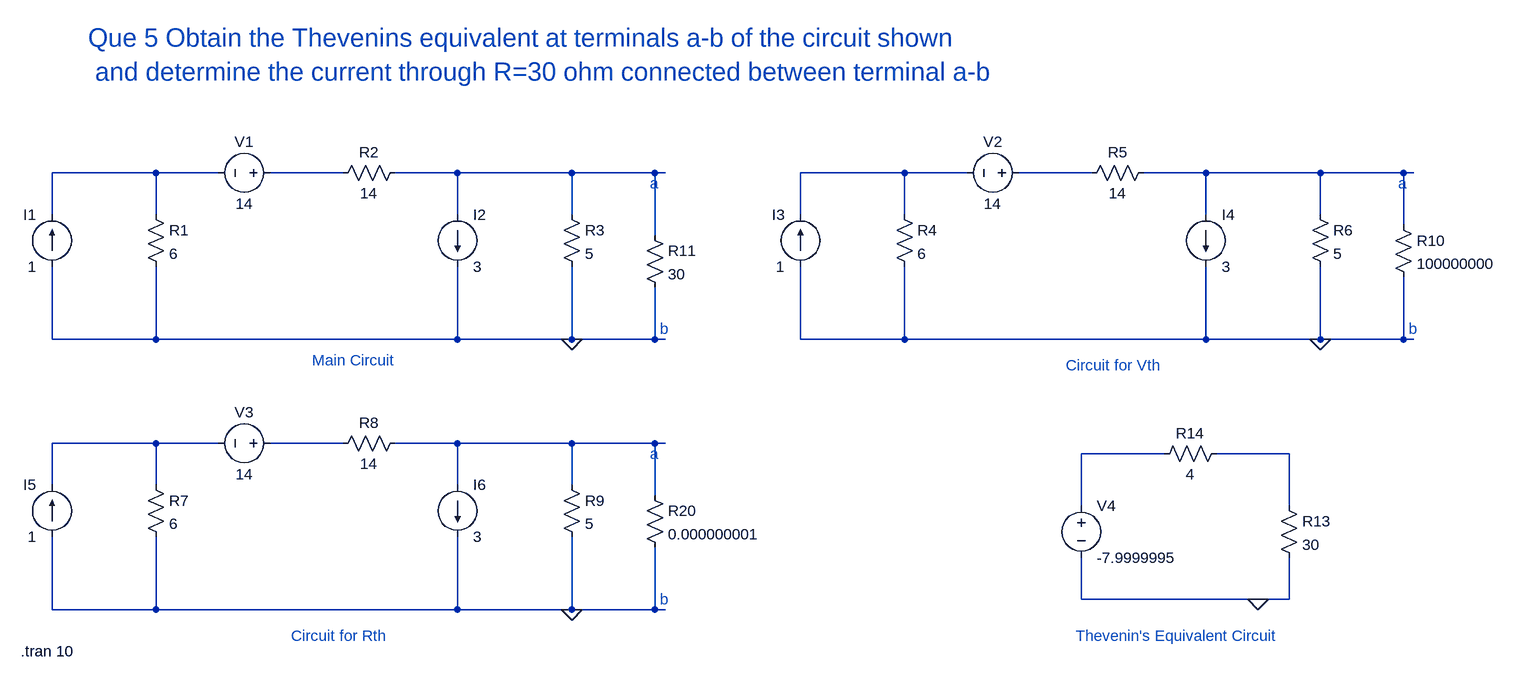
[diagram p0: schematic 5_Dheerendra_23EE019_Thevenins.asc]
5_Dheerendra_23EE019_Thevenins.asc, the LTspice schematic file:
Version 4
SHEET 1 2156 800
WIRE 80 48 -80 48
WIRE 176 48 80 48
WIRE 368 48 256 48
WIRE 544 48 448 48
WIRE 720 48 544 48
WIRE 848 48 720 48
WIRE 864 48 848 48
WIRE 1232 48 1072 48
WIRE 1328 48 1232 48
WIRE 1520 48 1408 48
WIRE 1696 48 1600 48
WIRE 1872 48 1696 48
WIRE 2000 48 1872 48
WIRE 2016 48 2000 48
WIRE -80 112 -80 48
WIRE 80 112 80 48
WIRE 544 112 544 48
WIRE 720 112 720 48
WIRE 1072 112 1072 48
WIRE 1232 112 1232 48
WIRE 1696 112 1696 48
WIRE 1872 112 1872 48
WIRE 2000 128 2000 48
WIRE 848 144 848 48
WIRE -80 304 -80 192
WIRE 80 304 80 192
WIRE 80 304 -80 304
WIRE 544 304 544 192
WIRE 544 304 80 304
WIRE 720 304 720 192
WIRE 720 304 544 304
WIRE 848 304 848 224
WIRE 848 304 720 304
WIRE 864 304 848 304
WIRE 1072 304 1072 192
WIRE 1232 304 1232 192
WIRE 1232 304 1072 304
WIRE 1696 304 1696 192
WIRE 1696 304 1232 304
WIRE 1872 304 1872 192
WIRE 1872 304 1696 304
WIRE 2000 304 2000 208
WIRE 2000 304 1872 304
WIRE 2016 304 2000 304
WIRE 80 464 -80 464
WIRE 176 464 80 464
WIRE 368 464 256 464
WIRE 544 464 448 464
WIRE 720 464 544 464
WIRE 848 464 720 464
WIRE 864 464 848 464
WIRE 1632 480 1504 480
WIRE 1824 480 1712 480
WIRE -80 528 -80 464
WIRE 80 528 80 464
WIRE 544 528 544 464
WIRE 720 528 720 464
WIRE 848 544 848 464
WIRE 1504 560 1504 480
WIRE 1824 560 1824 480
WIRE 1504 704 1504 640
WIRE 1776 704 1504 704
WIRE 1824 704 1824 640
WIRE 1824 704 1776 704
WIRE -80 720 -80 608
WIRE 80 720 80 608
WIRE 80 720 -80 720
WIRE 544 720 544 608
WIRE 544 720 80 720
WIRE 720 720 720 608
WIRE 720 720 544 720
WIRE 848 720 848 624
WIRE 848 720 720 720
WIRE 864 720 848 720
FLAG 720 304 0
FLAG 720 720 0
FLAG 1872 304 0
FLAG 1776 704 0
SYMBOL res 64 96 R0
SYMATTR InstName R1
SYMATTR Value 6
SYMBOL res 464 32 R90
WINDOW 0 0 56 VBottom 2
WINDOW 3 32 56 VTop 2
SYMATTR InstName R2
SYMATTR Value 14
SYMBOL voltage 272 48 R90
WINDOW 0 -32 56 VBottom 2
WINDOW 3 32 56 VTop 2
WINDOW 123 0 0 Left 0
WINDOW 39 0 0 Left 0
SYMATTR InstName V1
SYMATTR Value 14
SYMBOL current -80 192 R180
WINDOW 0 24 80 Left 2
WINDOW 3 24 0 Left 2
WINDOW 123 0 0 Left 0
WINDOW 39 0 0 Left 0
SYMATTR InstName I1
SYMATTR Value 1
SYMBOL current 544 112 R0
WINDOW 123 0 0 Left 0
WINDOW 39 0 0 Left 0
SYMATTR InstName I2
SYMATTR Value 3
SYMBOL res 704 96 R0
SYMATTR InstName R3
SYMATTR Value 5
SYMBOL res 1216 96 R0
SYMATTR InstName R4
SYMATTR Value 6
SYMBOL res 1616 32 R90
WINDOW 0 0 56 VBottom 2
WINDOW 3 32 56 VTop 2
SYMATTR InstName R5
SYMATTR Value 14
SYMBOL voltage 1424 48 R90
WINDOW 0 -32 56 VBottom 2
WINDOW 3 32 56 VTop 2
WINDOW 123 0 0 Left 0
WINDOW 39 0 0 Left 0
SYMATTR InstName V2
SYMATTR Value 14
SYMBOL current 1072 192 R180
WINDOW 0 24 80 Left 2
WINDOW 3 24 0 Left 2
WINDOW 123 0 0 Left 0
WINDOW 39 0 0 Left 0
SYMATTR InstName I3
SYMATTR Value 1
SYMBOL current 1696 112 R0
WINDOW 123 0 0 Left 0
WINDOW 39 0 0 Left 0
SYMATTR InstName I4
SYMATTR Value 3
SYMBOL res 1856 96 R0
SYMATTR InstName R6
SYMATTR Value 5
SYMBOL res 64 512 R0
SYMATTR InstName R7
SYMATTR Value 6
SYMBOL res 464 448 R90
WINDOW 0 0 56 VBottom 2
WINDOW 3 32 56 VTop 2
SYMATTR InstName R8
SYMATTR Value 14
SYMBOL voltage 272 464 R90
WINDOW 0 -32 56 VBottom 2
WINDOW 3 32 56 VTop 2
WINDOW 123 0 0 Left 0
WINDOW 39 0 0 Left 0
SYMATTR InstName V3
SYMATTR Value 14
SYMBOL current -80 608 R180
WINDOW 0 24 80 Left 2
WINDOW 3 24 0 Left 2
WINDOW 123 0 0 Left 0
WINDOW 39 0 0 Left 0
SYMATTR InstName I5
SYMATTR Value 1
SYMBOL current 544 528 R0
WINDOW 123 0 0 Left 0
WINDOW 39 0 0 Left 0
SYMATTR InstName I6
SYMATTR Value 3
SYMBOL res 704 512 R0
SYMATTR InstName R9
SYMATTR Value 5
SYMBOL res 1984 112 R0
SYMATTR InstName R10
SYMATTR Value 100000000
SYMBOL res 832 128 R0
SYMATTR InstName R11
SYMATTR Value 30
SYMBOL res 832 528 R0
SYMATTR InstName R20
SYMATTR Value 0.000000001
SYMBOL res 1808 544 R0
SYMATTR InstName R13
SYMATTR Value 30
SYMBOL res 1728 464 R90
WINDOW 0 0 56 VBottom 2
WINDOW 3 32 56 VTop 2
SYMATTR InstName R14
SYMATTR Value 4
SYMBOL voltage 1504 544 R0
WINDOW 123 0 0 Left 0
WINDOW 39 0 0 Left 0
SYMATTR InstName V4
SYMATTR Value -7.9999995
TEXT 840 64 Left 2 ;a
TEXT 856 288 Left 2 ;b
TEXT 1992 64 Left 2 ;a
TEXT 2008 288 Left 2 ;b
TEXT 840 480 Left 2 ;a
TEXT 856 704 Left 2 ;b
TEXT 320 336 Left 2 ;Main Circuit
TEXT 1480 344 Left 2 ;Circuit for Vth
TEXT 288 760 Left 2 ;Circuit for Rth
TEXT 1496 760 Left 2 ;Thevenin's Equivalent Circuit
TEXT -128 784 Left 2 !.tran 10
TEXT -24 -160 Left 4 ;Que 5 Obtain the Thevenins equivalent at terminals a-b of the circuit shown\n and determine the current through R=30 ohm connected between terminal a-b

The netlist it stands for:
* 5_Dheerendra_23EE019_Thevenins.asc
R1 N001 0 6
R2 N003 N002 14
V1 N002 N001 14
I1 0 N001 1
I2 N003 0 3
R3 N003 0 5
R4 N004 0 6
R5 N006 N005 14
V2 N005 N004 14
I3 0 N004 1
I4 N006 0 3
R6 N006 0 5
R7 N007 0 6
R8 N009 N008 14
V3 N008 N007 14
I5 0 N007 1
I6 N009 0 3
R9 N009 0 5
R10 N006 0 100000000
R11 N003 0 30
R20 N009 0 0.000000001
R13 N011 0 30
R14 N011 N010 4
V4 N010 0 -7.9999995
* a
* b
* a
* b
* a
* b
* Main Circuit
* Circuit for Vth
* Circuit for Rth
* Thevenin's Equivalent Circuit
.tran 10
* Que 5 Obtain the Thevenins equivalent at terminals a-b of the circuit shown
*  and determine the current through R=30 ohm connected between terminal a-b
.backanno
.end